# EAGLE design aHam_just_captm (EAGLE 9.6.2)
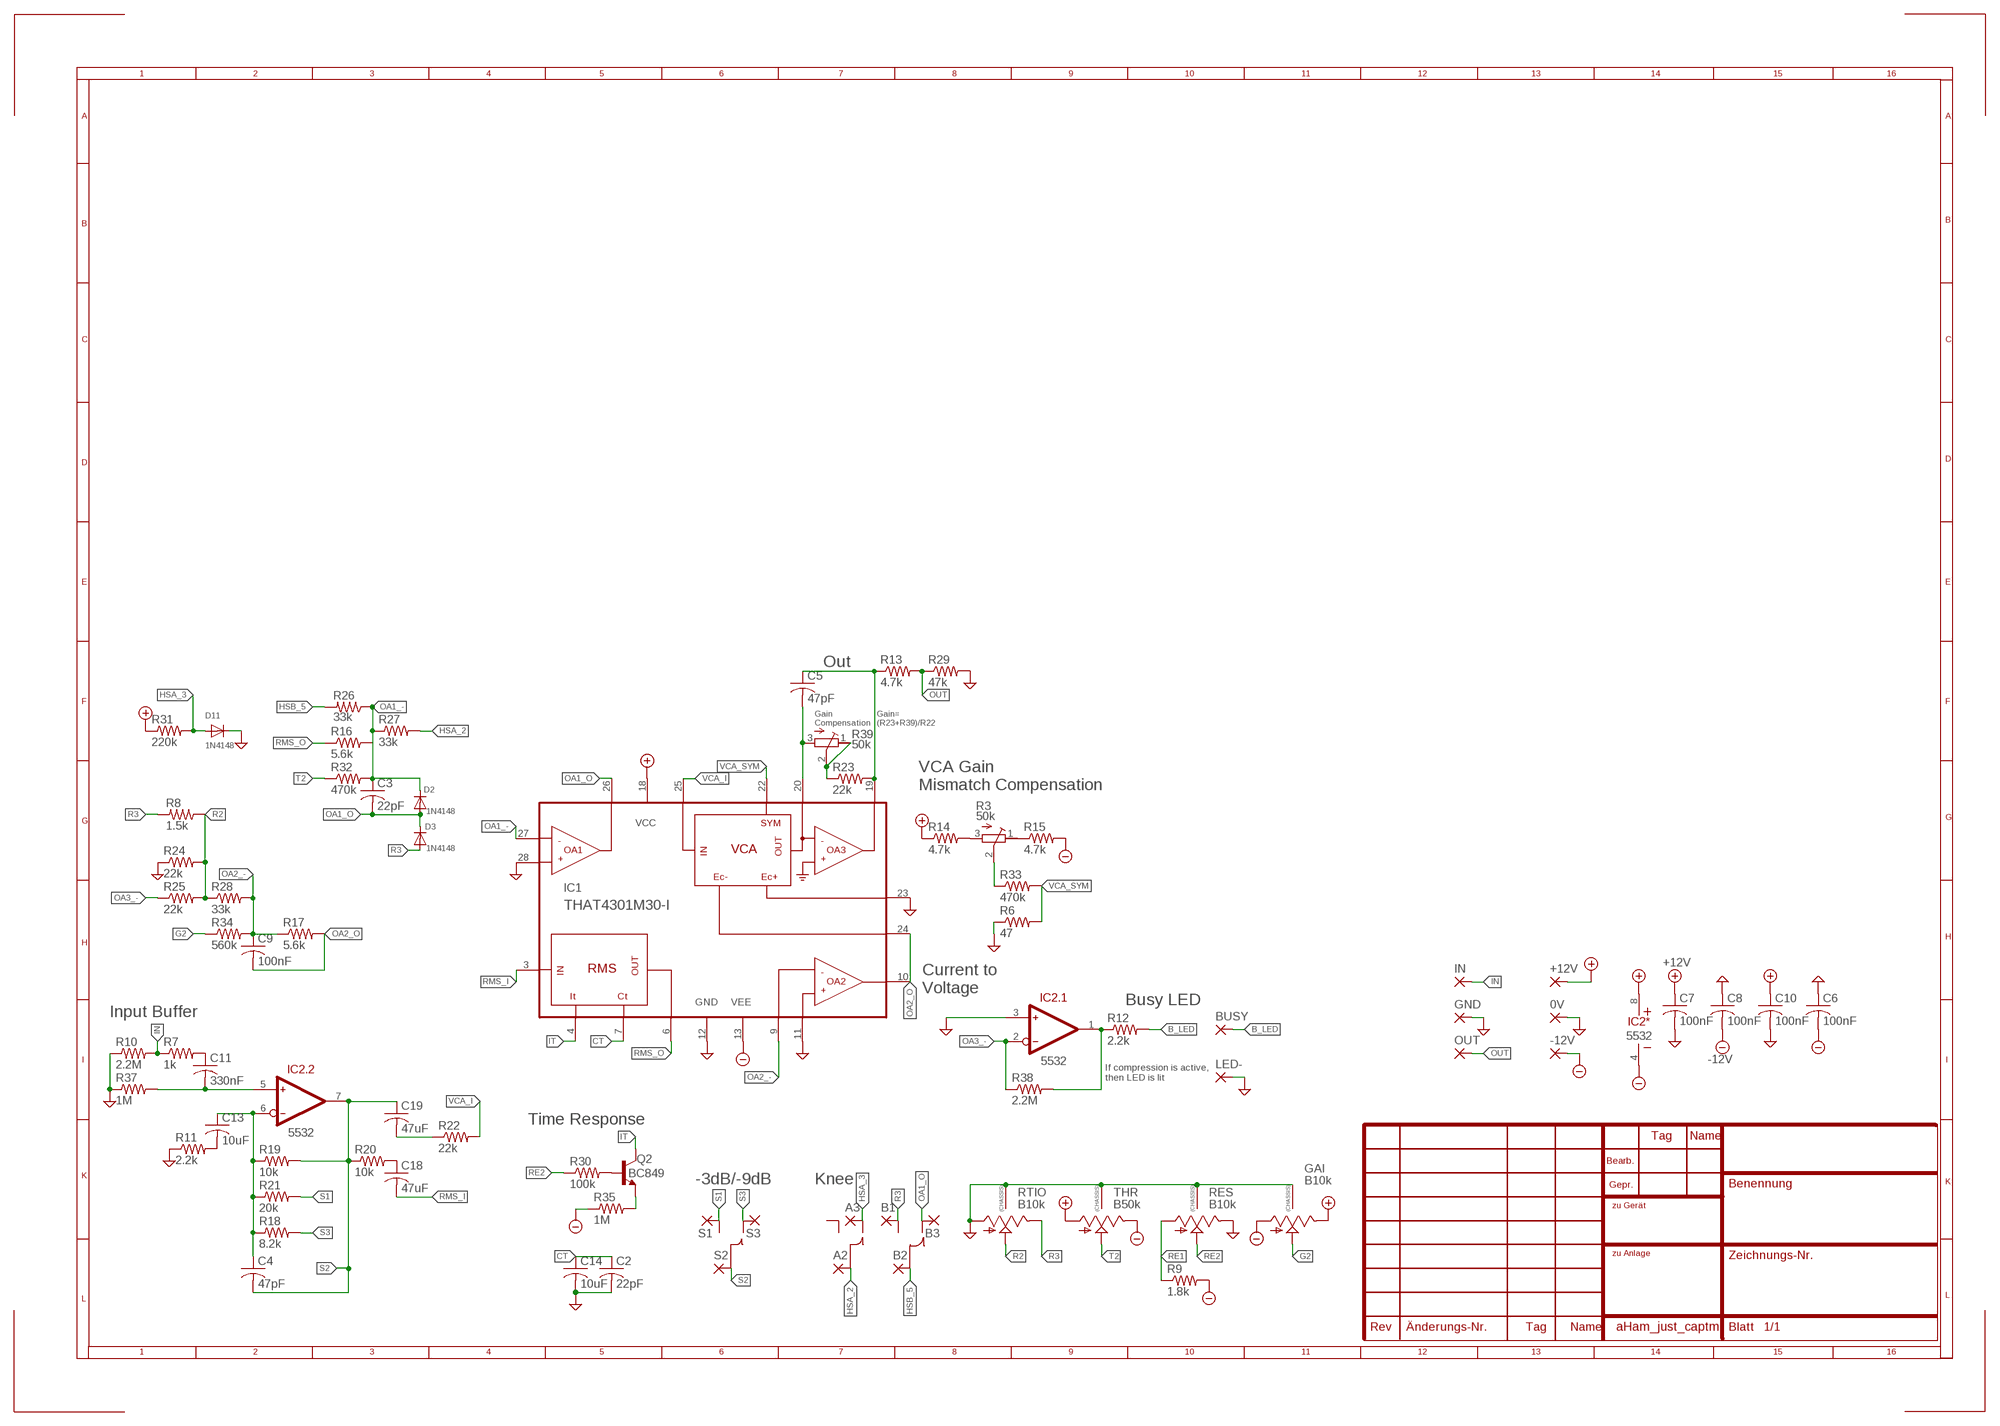
[diagram p0: schematic, sheet 1]

## Parts
0V  1,6/0,8  [1,6/0,8]
+12V  1,6/0,8  [1,6/0,8]
-12V  1,6/0,8  [1,6/0,8]
A2  1,6/0,8  [1,6/0,8]
A3  1,6/0,8  [1,6/0,8]
B1  1,6/0,8  [1,6/0,8]
B2  1,6/0,8  [1,6/0,8]
B3  1,6/0,8  [1,6/0,8]
BUSY  1,6/0,8  [1,6/0,8]
C2  22pF  C-USC0805  [C0805]
C3  22pF  C-USC0805  [C0805]
C4  47pF  C-USC0805  [C0805]
C5  47pF  C-USC0805  [C0805]
C6  100nF  C-USC0805  [C0805]
C7  100nF  C-USC0805  [C0805]
C8  100nF  C-USC0805  [C0805]
C9  100nF  C-USC0805  [C0805]
C10  100nF  C-USC0805  [C0805]
C11  330nF  C-USC0805  [C0805]
C13  10uF  C-USC1206  [C1206]
C14  10uF  C-USC1206  [C1206]
C18  47uF  C-USC1206  [C1206]
C19  47uF  C-USC1206  [C1206]
D2  1N4148  DIODESOD-123  [SOD-123]
D3  1N4148  DIODESOD-123  [SOD-123]
D11  1N4148  DIODESOD-123  [SOD-123]
GAI  B10k  9MM_SNAP-IN_POT_CHASSIS  [9MM_SNAP-IN_POT]
GND  1,6/0,8  [1,6/0,8]
IC1  THAT4301M30-I  [SO30W]
IC2  5532  NJM5532M  [SO-8]
IN  1,6/0,8  [1,6/0,8]
LED-  1,6/0,8  [1,6/0,8]
OUT  1,6/0,8  [1,6/0,8]
Q2  BC849  BC849-NPN-SOT23-BEC  [SOT23-BEC]
R3  50k  R-TRIMM3314G  [RTRIM3314G]
R6  47  R-US_R0805  [R0805]
R7  1k  R-US_R0805  [R0805]
R8  1.5k  R-US_R0805  [R0805]
R9  1.8k  R-US_R0805  [R0805]
R10  2.2M  R-US_R0805  [R0805]
R11  2.2k  R-US_R0805  [R0805]
R12  2.2k  R-US_R0805  [R0805]
R13  4.7k  R-US_R0805  [R0805]
R14  4.7k  R-US_R0805  [R0805]
R15  4.7k  R-US_R0805  [R0805]
R16  5.6k  R-US_R0805  [R0805]
R17  5.6k  R-US_R0805  [R0805]
R18  8.2k  R-US_R0805  [R0805]
R19  10k  R-US_R0805  [R0805]
R20  10k  R-US_R0805  [R0805]
R21  20k  R-US_R0805  [R0805]
R22  22k  R-US_R0805  [R0805]
R23  22k  R-US_R0805  [R0805]
R24  22k  R-US_R0805  [R0805]
R25  22k  R-US_R0805  [R0805]
R26  33k  R-US_R0805  [R0805]
R27  33k  R-US_R0805  [R0805]
R28  33k  R-US_R0805  [R0805]
R29  47k  R-US_R0805  [R0805]
R30  100k  R-US_R0805  [R0805]
R31  220k  R-US_R0805  [R0805]
R32  470k  R-US_R0805  [R0805]
R33  470k  R-US_R0805  [R0805]
R34  560k  R-US_R0805  [R0805]
R35  1M  R-US_R0805  [R0805]
R37  1M  R-US_R0805  [R0805]
R38  2.2M  R-US_R0805  [R0805]
R39  50k  R-TRIMM3314G  [RTRIM3314G]
RES  B10k  9MM_SNAP-IN_POT_CHASSIS  [9MM_SNAP-IN_POT]
RTIO  B10k  9MM_SNAP-IN_POT_CHASSIS  [9MM_SNAP-IN_POT]
S1  1,6/0,8  [1,6/0,8]
S2  1,6/0,8  [1,6/0,8]
S3  1,6/0,8  [1,6/0,8]
THR  B50k  9MM_SNAP-IN_POT_CHASSIS  [9MM_SNAP-IN_POT]

## Nets
+12V: +12V.1(P) C7.1 C10.1 GAI.3(E) IC1.18(VCC) IC2.8(*:V+) R14.1 R31.1 THR.1(A)
-12V: -12V.1(P) C6.2 C8.2 GAI.1(A) IC1.13(VEE) IC2.4(*:V-) R9.2 R15.2 R35.1 THR.3(E)
B_LED: BUSY.1(P) R12.2
CT: C2.1 C14.1 IC1.7(CT)
G2: GAI.2(S) R34.1
GND: 0V.1(P) C2.2 C6.1 C7.2 C8.1 C10.2 C14.2 D11.C GAI.CHASSIS1 GAI.CHASSIS2 GND.1(P) IC1.11(OA2_+IN) IC1.12(GND) IC1.23(EC+) IC1.28(OA1_+IN) IC2.3(.1:IN+) LED-.1(P) R6.1 R10.1 R11.1 R24.1 R29.2 R37.1 RES.3(E) RES.CHASSIS1 RES.CHASSIS2 RTIO.1(A) RTIO.CHASSIS1 RTIO.CHASSIS2 THR.CHASSIS1 THR.CHASSIS2
HSA_2: A2.1(P) R27.2
HSA_3: A3.1(P) D11.A R31.2
HSB_5: B2.1(P) R26.2
IN: IN.1(P) R7.1 R10.2
IT: IC1.4(IT) Q2.C
N$1: C4.1 C13.1 IC2.6(.2:IN-) R18.1 R19.1 R21.1
N$2: C11.1 R7.2
N$3: C11.2 IC2.5(.2:IN+) R37.2
N$4: C19.2 R22.1
N$5: C13.2 R11.2
N$6: C18.1 R20.2
N$7: C5.2 IC1.20(VCA_OUT) R39.3(A)
N$8: C5.1 IC1.19(OA3_OUT) R13.1 R23.2
N$9: R23.1 R39.1(E) R39.2(S)
N$10: Q2.B R30.2
N$11: Q2.E R35.2
N$12: R3.3(A) R14.2
N$13: R3.1(E) R15.1
N$14: R3.2(S) R33.1
N$15: IC2.1(.1:OUT) R12.1 R38.2
OA1_-: C3.1 D2.C IC1.27(OA1_-IN) R16.2 R26.1 R27.1 R32.2
OA1_O: B3.1(P) C3.2 D2.A D3.C IC1.26(OA1_OUT)
OA2_-: C9.1 IC1.9(OA2_-IN) R17.1 R28.2 R34.2
OA2_O: C9.2 IC1.10(OA2_OUT) IC1.24(EC-) R17.2
OA3_-: IC2.2(.1:IN-) R25.1 R38.1
OUT: OUT.1(P) R13.2 R29.1
R2: R8.1 R24.2 R25.2 R28.1 RTIO.2(S)
R3: B1.1(P) D3.A R8.2 RTIO.3(E)
RE1: R9.1 RES.1(A)
RE2: R30.1 RES.2(S)
RMS_I: C18.2 IC1.3(RMS_IN)
RMS_O: IC1.6(RMS_OUT) R16.1
S1: R21.2 S1.1(P)
S2: C4.2 C19.1 IC2.7(.2:OUT) R19.2 R20.1 S2.1(P)
S3: R18.2 S3.1(P)
T2: R32.1 THR.2(S)
VCA_I: IC1.25(VCA_IN) R22.2
VCA_SYM: IC1.22(SYM) R6.2 R33.2

## Notes on the sheet
- Out
- Gain
  Compensation
- Gain=
  (R23+R39)/R22
- VCA Gain
  Mismatch Compensation
- Current to
  Voltage
- Busy LED
- Input Buffer
- If compression is active,
  then LED is lit
- Time Response
- -3dB/-9dB | Knee

## Library data of the parts
0V +12V -12V A2 A3 B1-B3 BUSY GND IN LED- OUT S1-S3 = wirepad:1,6/0,8: THROUGH-HOLE PAD
C2-C11 C13 C14 C18 C19 = adafruit:C-US: CAPACITOR, American symbol
D2 D3 D11 = adafruit:DIODE: Diode SMADIODE - SMA Surface Mount Package 20V 1A Schottky Diode Digikey: 641-1014-6-ND DO-1N4148 - Through Hole Small Current Diode SOD-123 20V 1 A (.5mV Vf) Schottky Diode - Digikey: MBRX120TPMSCT-ND SOD-323 10V 570mA (.38mV Vf, 3ns) Schottky Diode - Digikey: ZLLS410CT-ND SOD-523 30V 30mA Schottky Diode (RB751S-40TE61) - Digikey: RB751S-40TE61CT-ND SOT23-R/W - SOT23 Package (R = Solder Paste/Reflow Ovens, W = Hand-Soldering) BAT54Film 40V 300mA - Digikey: 497-7162-1-ND
GAI RES RTIO THR = MusicThingModular:9MM_SNAP-IN_POT_CHASSIS: 9mm vertical snap-in pot, Alpha / Panasonic style, with a connection to the metal chassis for grounding
IC1 = that-corp:THAT4301: THAT Analog Engine® IC Dynamics Processor
IC2 = ic-jrc:NJM5532; MOUSER: 513-NJM5532M
Q2 = MusicThingModular:*-NPN-: NPN Transistror BF959 corrected 2008.03.06
R3 R39 = resistor:R-TRIMM: Trimm resistor
R6-R35 R37 R38 = adafruit:R-US_: RESISTOR, American symbol

## Board
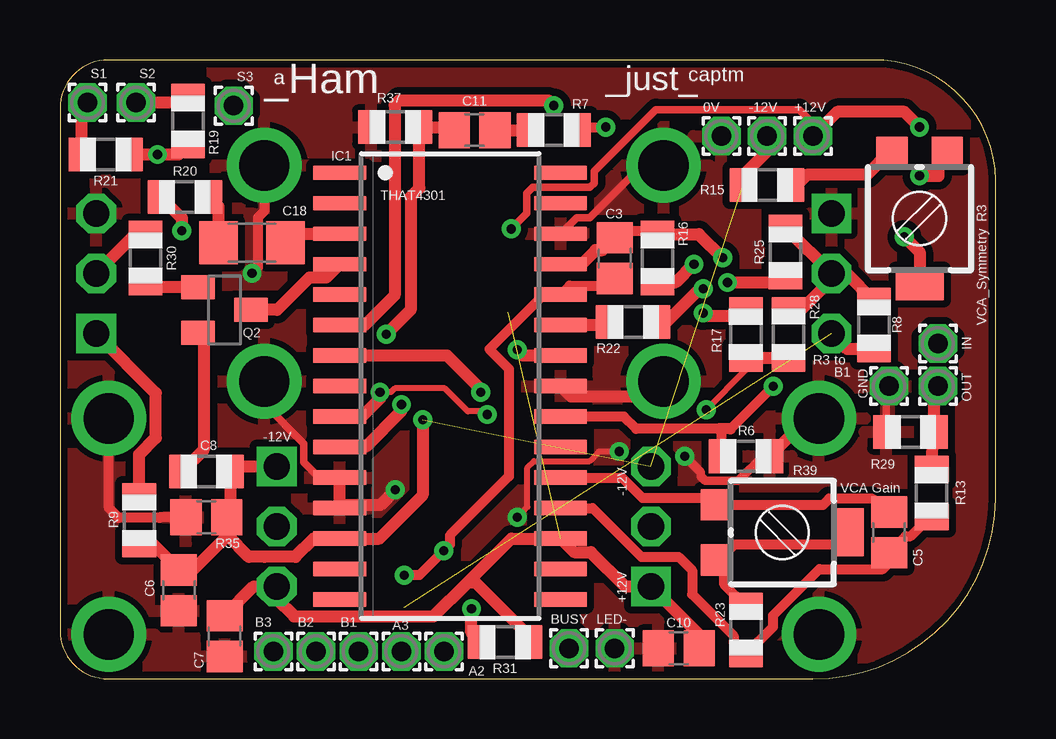
[diagram p1: board, top side]
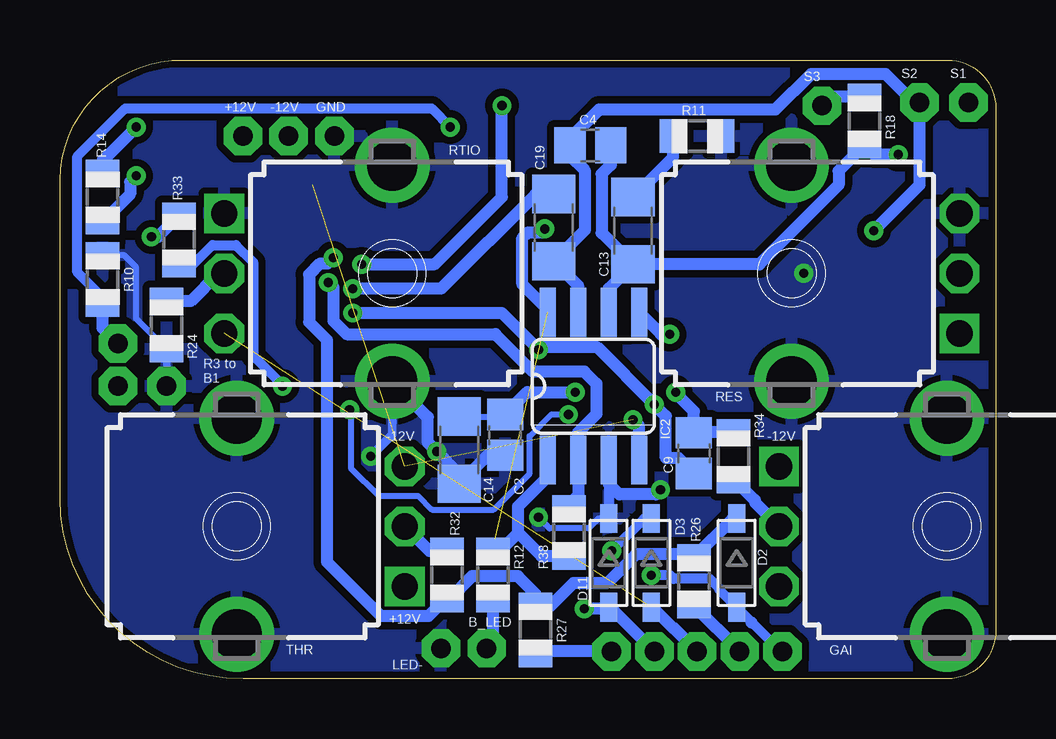
[diagram p2: board, bottom side, seen from below]

Size 38.99 x 25.78 mm. Coordinates in mm from the lower left corner, seen from the top.
Outline: 0,23.78 0,2 arc90 2,0 31.36,0 arc90 38.99,7.5 38.99,20.78 arc90 33.86,25.78 2,25.78 arc90 0,23.78
Copper layers (1*16): Top 0.035mm / dielectric 1.5mm / Bottom 0.035mm
Design rules "default *": minimum track width 6mil, minimum drill 0.35mm, track to track 6mil, track to pad 6mil, pad to pad 6mil, via to via 6mil, smd to smd 6mil, copper to edge 10mil, drill to drill 6mil, minimum pad ring 10mil, minimum via ring 8mil, stop-mask expansion 4mil, vias tented up to drill 0mil, thermal gap 10mil

### Footprints (pad centres in the part's own frame; a part is rotated, then mirrored left to right if it is on the bottom)
1,6/0,8 = drill 0.813 pad 1.6 octagon: 1 0,0
C0805 = smd 1.3 x 1.5: 1 -0.85,0; 2 0.85,0
C1206 = smd 1.6 x 1.8: 1 -1.4,0; 2 1.4,0
SOD-123 = smd 1.2 x 0.7: A 1.85,0; C -1.85,0
9MM_SNAP-IN_POT = drill 1.1 square: 1 -2.5,-7 | drill 1.1 octagon: 2 0,-7; 3 2.5,-7 | drill 2.1 pad 2.794: CHASSIS1 -4.5,0; CHASSIS2 4.5,0
SO30W = smd 0.6 x 2.2: 1 -8.89,-4.6; 2 -7.62,-4.6; 3 -6.35,-4.6; 4 -5.08,-4.6; 5 -3.81,-4.6; 6 -2.54,-4.6; 7 -1.27,-4.6; 8 0,-4.6; 9 1.27,-4.6; 10 2.54,-4.6; 11 3.81,-4.6; 12 5.08,-4.6; 13 6.35,-4.6; 14 7.62,-4.6; 15 8.89,-4.6; 16 8.89,4.6; 17 7.62,4.6; 18 6.35,4.6; 19 5.08,4.6; 20 3.81,4.6; 21 2.54,4.6; 22 1.27,4.6; 23 0,4.6; 24 -1.27,4.6; 25 -2.54,4.6; 26 -3.81,4.6; 27 -5.08,4.6; 28 -6.35,4.6; 29 -7.62,4.6; 30 -8.89,4.6
SO-8 = smd 0.66 x 2.032: 1 -1.905,-3.073; 2 -0.635,-3.073; 3 0.635,-3.073; 4 1.905,-3.073; 5 1.905,3.073; 6 0.635,3.073; 7 -0.635,3.073; 8 -1.905,3.073
SOT23-BEC = smd 1 x 1.4: B -0.95,-1.1; C 0,1.1; E 0.95,-1.1
RTRIM3314G = smd 1.3 x 1.3: 1 1.15,-2.75; 3 -1.15,-2.75 | smd 2 x 1.3: 2 0,2.75
R0805 = smd 1.1 x 1.4: 1 -1,0; 2 1,0

### Placement (x,y rotation side)
0V  27.56,22.61 0 top
+12V  31.37,22.61 0 top
-12V  29.46,22.61 0 top
A2  16,1.14 0 top
A3  14.22,1.14 0 top
B1  12.45,1.14 0 top
B2  10.67,1.14 0 top
B3  8.89,1.14 0 top
BUSY  21.21,1.27 0 top
C2  20.45,10.16 270 bottom
C3  23.11,17.53 270 top
C4  16.89,22.23 180 bottom
C5  34.54,6.1 90 top
C6  4.95,3.68 90 top
C7  6.86,1.78 270 top
C8  6.1,6.73 0 top
C9  12.57,9.4 270 bottom
C10  25.78,1.27 180 top
C11  17.27,22.86 180 top
C13  15.11,18.67 90 bottom
C14  22.35,9.53 270 bottom
C18  8,18.16 0 top
C19  18.41,18.8 90 bottom
D2  10.79,4.83 270 bottom
D3  14.35,4.83 270 bottom
D11  16.13,4.83 270 bottom
GAI  2.03,6.35 270 bottom
GND  34.54,12.19 0 top
IC1  16.26,12.19 270 top
IC2  16.76,12.19 0 bottom
IN  36.58,13.97 0 top
LED-  23.11,1.27 0 top
OUT  36.58,12.19 0 top
Q2  6.86,15.37 270 top
R3  35.81,19.18 180 top
R6  28.57,9.27 180 top
R7  20.57,22.86 180 top
R8  33.91,14.73 270 top
R9  3.3,6.6 270 top
R10  37.21,16.64 270 bottom
R11  12.45,22.61 180 bottom
R12  20.95,4.32 270 bottom
R13  36.32,7.75 90 top
R14  37.21,20.07 270 bottom
R15  29.46,20.57 180 top
R16  24.89,17.53 90 top
R17  28.57,14.35 90 top
R18  5.46,23.24 90 bottom
R19  5.33,23.24 90 top
R20  5.21,20.07 0 top
R21  1.91,21.84 180 top
R22  23.88,14.86 180 top
R23  28.57,2.03 270 top
R24  34.54,14.73 90 bottom
R25  30.23,17.78 90 top
R26  12.57,4.06 270 bottom
R27  19.18,2.03 270 bottom
R28  30.35,14.35 270 top
R29  35.43,10.29 180 top
R30  3.56,17.53 270 top
R31  18.54,1.52 180 top
R32  22.86,4.32 270 bottom
R33  34.04,18.29 270 bottom
R34  10.92,9.27 90 bottom
R35  6.1,8.64 180 top
R37  13.97,22.99 0 top
R38  17.78,6.1 270 bottom
R39  30.1,6.1 270 top
RES  8.51,16.89 90 bottom
RTIO  25.15,16.89 270 bottom
S1  1.14,24 0 top
S2  3.17,24 0 top
S3  7.24,23.88 0 top
THR  31.62,6.35 90 bottom

### Tracks (layer width: path | path; a pad name or v marks a point on that pad's centre or on a via)
+12V  (via drill 0.38)  (1 unrouted)
  Top 0.305: v18.8,18.74 19.45,19.4 19.45,20.24 19.69,20.48 22.08,20.48 22.26,20.66 22.26,21.14 24.83,23.71 30.81,23.71 31.37,23.15 +12V.1
  Top 0.508: 19.76,1.52 R31.1 19.54,1.78 17.32,4 16.96,4 | v35.81,22.99 35.18,23.62 32.38,23.62 +12V.1 | C7.1 8.08,3.85 GAI.3 9.03,3.32 9.75,2.6 15.56,2.6 16.96,4 | 16.96,4 18.81,5.84 IC1.18 21.42,5.28 22.12,5.28 23.55,3.85 THR.1 26.63,1.84 C10.1
  Bottom 0.508: R14.1 37.21,21.59 v35.81,22.99 | IC2.8 18.67,15.38 19.72,16.43 19.72,18.36 19.48,18.6 18.94,18.6 v18.8,18.74
-12V  (via drill 0.38)  (2 unrouted)
  Top 0.508: GAI.1 7.31,8.85 R35.1 7.1,6.88 C8.2 6.99,6.69 6.99,5.97 | 8.52,5.08 | 8.52,5.08 9.81,5.08 10.57,5.84 IC1.13 13.31,5.84 15.11,7.65 v15.11,10.79 | R15.2 28.46,20.97 29.46,21.97 -12V.1 | R9.2 3.88,5.6 C6.2 5.55,4.53 6.99,5.97 | 8.52,5.08 7.87,5.08 6.99,5.97
  Bottom 0.508: v15.11,10.79 14.86,10.54 IC2.4
B_LED
  Bottom 0.508: R12.2 20.95,1.52 BUSY.1
CT  (via drill 0.38)
  Top 0.508: IC1.7 16.13,13.46 17.53,12.06 v17.53,11.94
  Bottom 0.254: C14.1 20.53,10.93 C2.1
  Bottom 0.508: C2.1 19.52,11.94 v17.53,11.94
G2
  Bottom 0.508: GAI.2 10.04,7.36 10.04,7.44 10.87,8.27 R34.1
GND  (via drill 0.38)
  Top 0.254: v19.05,6.73 19.48,7.16 19.48,8.8 19.75,9.07 22.07,9.07 22.47,9.47 v23.3,9.47
  Top 0.305: IC1.28 21.52,19.21 22.08,19.21 24.27,21.39 RTIO.CHASSIS1 | R29.2 34.43,12.08 GND.1 | RES.CHASSIS1 8.51,11.45 10.16,9.8 10.16,9.02 10.79,8.38 IC1.11
  Top 0.356: v26.04,9.27 26.7,8.61 26.7,8.43 26.89,8.24 28.26,8.24 29.29,9.27 R6.1
  Top 0.406: C8.1 4.18,6.73 4.15,6.7 2.46,6.7 2.03,7.12 GAI.CHASSIS1 | v8,16.89 8.24,17.14 8.24,19.21 8.51,19.47 RES.CHASSIS2
  Top 0.508: IC1.23 21.29,11.76 24.51,11.76 RTIO.CHASSIS2 | IC1.11 IC1.12 11.78,7.24 13.34,7.24 v13.97,7.87 | R6.1 31.15,10.85 THR.CHASSIS2
  Bottom 0.254: R24.1 35.81,15 35.81,17.14 36.31,17.64 R10.1 | D11.C 16.55,6.68 16.96,6.27 18.6,6.27 18.76,6.43 18.76,6.44 v19.05,6.73
  Bottom 0.305: R24.1 GND.1
  Bottom 0.356: RTIO.CHASSIS2 25.15,10.16 v26.04,9.27
  Bottom 0.406: IC2.3 16.13,8.13 D11.C
  Bottom 0.508: C2.2 21.17,9.31 C14.2 22.35,8.52 v23.3,9.47 23.66,9.83 23.66,10.9 RTIO.CHASSIS2 | v13.97,7.87 14.16,7.68 15.68,7.68 16.13,8.13
  pour Bottom (isolate 0.305): -2.54,27.94 -2.54,-1.27 40.64,-1.27 40.64,27.94
  pour Top (isolate 0.305): -2.54,27.94 -2.54,-1.27 40.64,-1.27 40.64,27.94
HSA_2
  Bottom 0.508: A2.1 19.07,1.14 R27.2
HSA_3  (via drill 0.38)
  Top 0.508: R31.2 17.14,1.92 v17.14,2.92
  Bottom 0.508: A3.1 16.06,2.98 D11.A 16.18,2.92 v17.14,2.92
HSB_5
  Bottom 0.508: B2.1 12.57,3.05 R26.2
IN  (via drill 0.38)
  Top 0.406: R7.1 21.7,22.99 v22.73,22.99
  Bottom 0.406: v22.73,22.99 23.51,23.76 36.27,23.76 38.27,21.76 38.27,16.94 37.21,15.88 R10.2
  Bottom 0.508: IN.1 37.21,14.61 R10.2
IT
  Top 0.508: IC1.4 11.09,16.71 10.39,16.71 9.05,15.37 Q2.C
N$1  (via drill 0.38)
  Top 0.508: R21.1 v4.06,21.84 4.94,21.84 R19.1
  Bottom 0.508: C4.1 16.04,21.42 16.42,21.04 16.42,18.57 C13.1 | C13.1 16.13,16.25 IC2.6 | v4.06,21.84 5.06,21.84 R18.1 6.54,21.16 6.54,20.58 9.85,17.27 C13.1
N$2
  Top 0.508: C11.1 R7.2
N$3  (via drill 0.38)
  Top 0.508: C11.2 16.3,22.99 R37.2 14.97,20.45 14.61,20.08 14.61,15.37 v13.59,14.35
  Bottom 0.508: IC2.5 13.95,14.35 v13.59,14.35
N$4  (via drill 0.38)
  Top 0.508: R22.1 25.26,14.86 26.65,16.26 v26.8,16.26
  Bottom 0.508: C19.2 19.17,20.2 23.11,16.26 v26.8,16.26
N$5
  Bottom 0.508: C13.2 13.45,21.74 R11.2
N$6
  Top 0.508: R20.2 6.6,19.67 C18.1
N$7
  Top 0.406: IC1.20 23.42,8.38 24.27,7.53 27.06,7.53 R39.3 31.79,7.25 32.05,7.5 33.81,7.5 34.16,7.33 C5.2
N$8
  Top 0.406: IC1.19 22.19,7.11 24.22,5.08 25.78,5.08 26.34,4.52 26.34,3.51 28.07,1.79 28.07,1.54 R23.2 29.71,2.17 29.71,2.64 31.64,4.57 34.29,4.57 34.54,4.83 C5.1 35.24,5.94 35.44,5.94 36.25,6.75 R13.1
N$9
  Top 0.406: R39.1 27.69,4.95 | R23.1 27.69,3.92 27.69,4.95 | 27.69,4.95 27.69,5.2 28.07,5.59 32.34,5.59 R39.2
N$10
  Top 0.508: Q2.B 3.77,16.32 R30.2
N$11
  Top 0.508: Q2.E 5.99,14.19 5.99,9.53 R35.2
N$12  (via drill 0.38)
  Top 0.508: v35.81,20.95 36.61,20.95 36.61,21.58 R3.3
  Bottom 0.508: R14.2 37.2,19.07 36.07,20.19 36.07,20.7 v35.81,20.95
N$13
  Top 0.508: R3.1 34.55,21.93 33.65,21.02 31.16,21.02 30.72,20.57 R15.1
N$14  (via drill 0.38)
  Top 0.508: v35.18,18.41 35.81,17.78 R3.2
  Bottom 0.508: v35.18,18.41 34.91,18.41 R33.1
N$15
  Bottom 0.508: IC2.1 18.67,8.41 19.9,7.18 19.9,6.08 | R38.2 18.92,5.1 19.9,6.08 | R12.1 20.66,5.32 19.9,6.08
OA1_-  (via drill 0.38)
  Top 0.406: R16.2 25.04,18.67 23.41,18.67 C3.1
  Top 0.508: C3.1 22.6,17.86 22.32,17.86 21.73,17.27 IC1.27 | R16.2 26.62,18.53 v27.61,17.53
  Bottom 0.508: D2.C 10.96,6.68 R26.1 12.7,5.19 14.99,5.19 16.2,3.98 17.6,3.98 18.55,3.03 R27.1 19.18,3.54 19.91,4.27 21.82,4.27 22.78,3.32 R32.2 22.93,3.32 23.63,2.62 25.62,2.62 27.87,4.88 27.87,14.12 28.61,14.86 28.61,16.84 28.14,17.31 27.83,17.31 v27.61,17.53
OA1_O  (via drill 0.38)
  Top 0.406: 22.99,16.38 21.24,16.38 IC1.26 20.15,16 17.89,13.74 18.71,12.91 18.71,8.43 16.25,5.97 16.25,5.59 v15.99,5.33 14.98,4.32 v14.35,4.32 | 23.11,16.51 C3.2
  Top 0.508: 22.99,16.38 23.11,16.51
  Bottom 0.406: 8.96,1.14 10.17,2.35 D2.A 11.52,3.7 11.52,3.76 11.91,4.16 13.42,4.16 13.58,4.32 v14.35,4.32 | v15.99,5.33 14.65,6.68 D3.C
  Bottom 0.508: 8.96,1.14 B3.1 | 10.17,2.35
OA2_-  (via drill 0.38)
  Top 0.254: R17.1 28.57,12.87 v26.92,11.21 | v13.34,11.94 13.79,11.94 13.95,12.1 16.03,12.1 16.99,11.14 17.67,11.14 v17.8,11.01
  Top 0.508: v13.34,11.94 13.34,11.68 12.57,10.92 IC1.9 | R28.2 R17.1
  Bottom 0.254: v17.8,11.01 18.52,11.01 19.42,10.11 19.42,8.54 20.92,7.05 23.5,7.05 24.07,7.62 25.71,7.62 26.87,8.77 26.87,11.16 v26.92,11.21
  Bottom 0.508: R34.2 12.55,10.27 C9.1 12.57,11.14 13.34,11.9 v13.34,11.94
OA2_O  (via drill 0.38)
  Top 0.508: IC1.24 19.29,13.46 v19.05,13.7 | R17.2 28.34,15.11 26.92,15.11 v26.8,15.24 | v14.23,11.43 14.23,11.17 12.71,9.65 IC1.10
  Bottom 0.508: v26.8,15.24 20.59,15.24 v19.05,13.7 18.92,13.83 16.63,13.83 v14.23,11.43 13.74,10.94 13.74,9.19 13.22,9.19 C9.2
OA3_-  (via drill 0.38)
  Top 0.508: R25.1 29.96,16.51 v27.81,16.51
  Bottom 0.508: v27.81,16.51 27.6,16.29 27.6,14.91 27.04,14.36 20.84,14.36 19.29,12.8 17.14,12.8 16.64,12.29 16.64,11.02 17.4,10.26 IC2.2 17.4,7.64 17.78,7.26 R38.1
OUT
  Top 0.508: R13.2 36.34,10.29 R29.1 36.43,12.05 OUT.1
R2
  Top 0.508: RTIO.2 32.75,16.89 R8.1 | R25.2 30.26,18.78 RTIO.2 | R28.1 30.86,15.35 32.15,16.64 RTIO.2
  Bottom 0.508: RTIO.2 32.38,16.89 33.54,15.73 R24.2
R3  (1 unrouted)
  Top 0.508: R8.2 32.8,13.73 RTIO.3
  Bottom 0.508: B1.1 13.41,2.11 13.44,2.11 14.31,2.98 D3.A
RE1
  Top 0.508: R9.1 3.3,9.34 4,10.04 4,11.9 RES.1
RE2
  Top 0.508: RES.2 3.14,18.53 R30.1
RMS_I
  Top 0.508: C18.2 9.78,18.54 IC1.3
RMS_O  (via drill 0.38)
  Top 0.508: R16.1 25.67,16.53 v26.42,17.27 | v20.57,23.88 20.36,24.09 14.12,24.09 13.95,23.91 13.95,15.98 12.7,14.73 IC1.6
  Bottom 0.508: v26.42,17.27 23.37,17.27 20.57,20.07 v20.57,23.88
S1
  Top 0.508: R21.2 0.91,23.77 S1.1
S2  (via drill 0.38)
  Top 0.508: R20.1 5.08,19.19 v5.08,18.67 | R19.2 5.1,24 S2.1
  Bottom 0.508: IC2.7 17.4,16.38 C19.1 17.11,18.7 17.11,21.16 17.74,21.8 C4.2 17.74,22.5 16.53,23.71 9.18,23.71 7.7,25.2 4.59,25.2 3.4,24 S2.1 3.17,20.57 v5.08,18.67
S3
  Bottom 0.508: R18.2 6.87,24.24 S3.1
T2
  Bottom 0.508: R32.1 23.59,5.32 THR.2
VCA_I
  Top 0.508: R22.2 22.75,14.73 IC1.25
VCA_SYM  (via drill 0.38)
  Top 0.406: IC1.22 23.5,10.92 24,10.41 27.43,10.41 27.57,10.27 R6.2 | v29.72,12.19 27.94,10.41
  Top 0.457: 27.94,10.41 27.43,10.41
  Bottom 0.406: 29.72,12.23 30.94,13.45 30.94,17.36 31.66,18.07 32.63,18.07 33.42,17.29 R33.2
  Bottom 0.508: v29.72,12.19 29.72,12.23

### Text on the board
tPlace: a | _just_ | captm | _Ham | THAT4301 | VCA_Symmetry | R3 to | B1 | -12V | -12V | VCA Gain | +12V
bPlace: S1 | S2 | S3 | GND | -12V | +12V | R3 to / B1 | -12V | -12V | B_LED | +12V | LED-